# EAGLE schematic TEst2 (EAGLE 9.2.2)
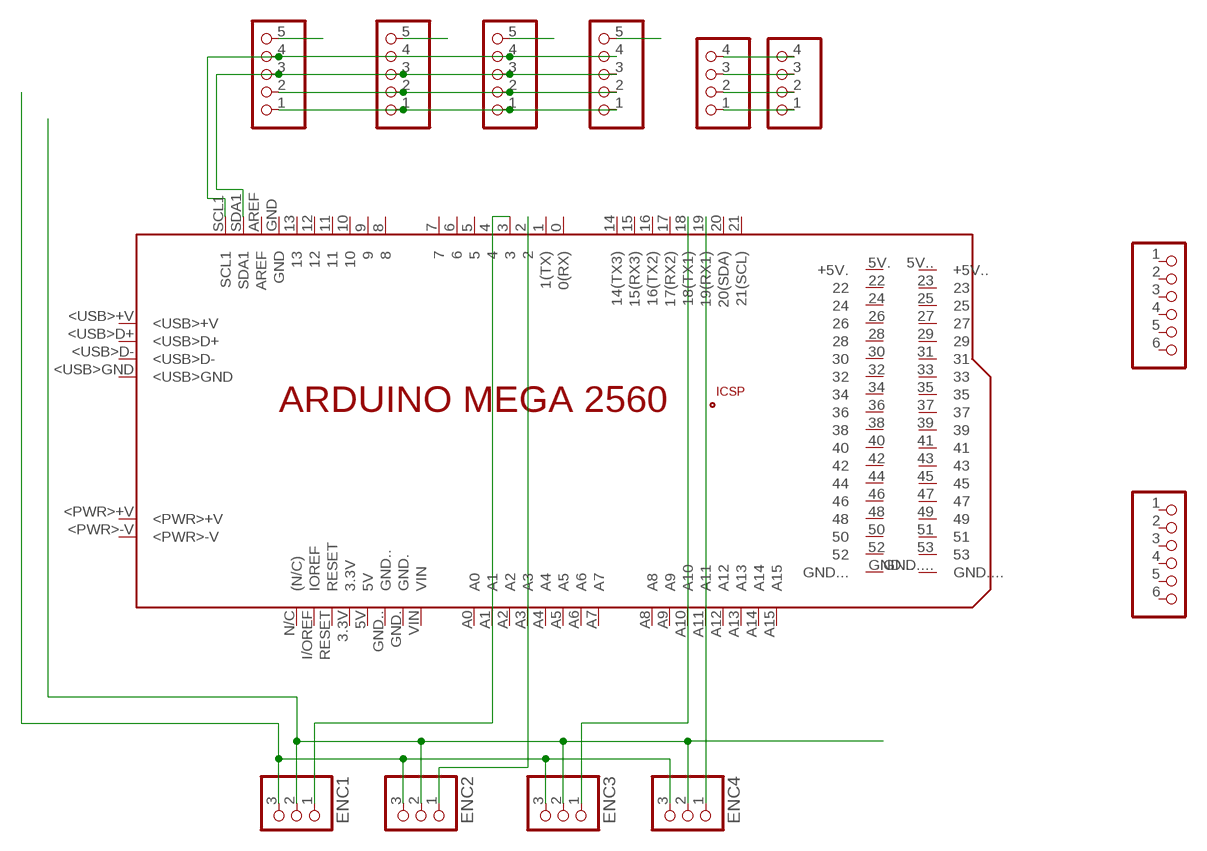
[diagram p0: schematic, sheet 1]

## Parts
ENC1  PINHD-1X3  [1X03]
ENC2  PINHD-1X3  [1X03]
ENC3  PINHD-1X3  [1X03]
ENC4  PINHD-1X3  [1X03]
IMU  PINHD-1X4  [1X04]
L1  PINHD-1X55X2MM  [1_05X2MM]
L2  PINHD-1X55X2MM  [1_05X2MM]
L3  PINHD-1X55X2MM  [1_05X2MM]
L4  PINHD-1X55X2MM  [1_05X2MM]
MC1  PINHD-1X6  [1X06]
MC2  PINHD-1X6  [1X06]
OLED  PINHD-1X4  [1X04]
PCB1  ARDUINO_MEGA2560  [ARDUINO_MEGA2560]

## Nets
N$1: L1.3 L2.3 L3.3 L4.3 PCB1.SDA1
N$2: IMU.1 OLED.1
N$3: IMU.2 OLED.2
N$4: ENC1.1 PCB1.3
N$5: L1.4 L2.4 L3.4 L4.4 PCB1.SCL1
N$6: ENC2.1 PCB1.2
N$7: ENC1.3 ENC2.3 ENC3.3 ENC4.3
N$8: ENC1.2 ENC2.2 ENC3.2 ENC4.2
N$9: IMU.3 OLED.3
N$10: ENC3.1 PCB1.18(18(TX1))
N$11: ENC4.1 PCB1.19(19(RX1))
N$12: IMU.4 OLED.4
N$13: L1.1 L2.1 L3.1 L4.1
N$14: L1.2 L2.2 L3.2 L4.2
N$15: L4.5
N$16: L3.5
N$18: L1.5
N$19: L2.5
Unconnected: MC1.1 MC1.2 MC1.3 MC1.4 MC1.5 MC1.6 MC2.1 MC2.2 MC2.3 MC2.4 MC2.5 MC2.6 PCB1.0(0(RX)) PCB1.1(1(TX)) PCB1.3.3V PCB1.4 PCB1.5 PCB1.5V PCB1.5V.(+5V.) PCB1.5V..(+5V..) PCB1.6 PCB1.7 PCB1.8 PCB1.9 PCB1.10 PCB1.11 PCB1.12 PCB1.13 PCB1.14(14(TX3)) PCB1.15(15(RX3)) PCB1.16(16(TX2)) PCB1.17(17(RX2)) PCB1.20(20(SDA)) PCB1.21(21(SCL)) PCB1.22 PCB1.23 PCB1.24 PCB1.25 PCB1.26 PCB1.27 PCB1.28 PCB1.29 PCB1.30 PCB1.31 PCB1.32 PCB1.33 PCB1.34 PCB1.35 PCB1.36 PCB1.37 PCB1.38 PCB1.39 PCB1.40 PCB1.41 PCB1.42 PCB1.43 PCB1.44 PCB1.45 PCB1.46 PCB1.47 PCB1.48 PCB1.49 PCB1.50 PCB1.51 PCB1.52 PCB1.53 PCB1.+5V_ PCB1.<PWR>+V PCB1.<PWR>-V PCB1.<USB>+V PCB1.<USB>D+ PCB1.<USB>D- PCB1.<USB>GND PCB1.A0 PCB1.A1 PCB1.A2 PCB1.A3 PCB1.A4 PCB1.A5 PCB1.A6 PCB1.A7 PCB1.A8 PCB1.A9 PCB1.A10 PCB1.A11 PCB1.A12 PCB1.A13 PCB1.A14 PCB1.A15 PCB1.AREF PCB1.GND PCB1.GND. PCB1.GND.. PCB1.GND... PCB1.GND.... PCB1.GND__ PCB1.I/OREF(IOREF) PCB1.MISO PCB1.MOSI PCB1.N/C((N/C)) PCB1.RESET PCB1.RESET. PCB1.SCK PCB1.VIN

## Library data of the parts
ENC1-ENC4 = pinhead:PINHD-1X3: PIN HEADER
IMU OLED = pinhead:PINHD-1X4: PIN HEADER
L1-L4 = pinhead:PINHD-1X5: PIN HEADER
MC1 MC2 = pinhead:PINHD-1X6: PIN HEADER
PCB1 = E14_Arduino_revC:ARDUINO_MEGA2560: Device for representing an Arduino Mega 2560 board with a footprint in an EAGLE design. Created by Dave Young for Element14. More EAGLE documentation at: http://www.element14.com/community/community/knode/cadsoft_eagle